# Altium schematic sheet jtag.SchDoc: TMS320F28388 JTAG/RESET/OSC
size A4; SheetNumber: 6; SheetTotal: 17
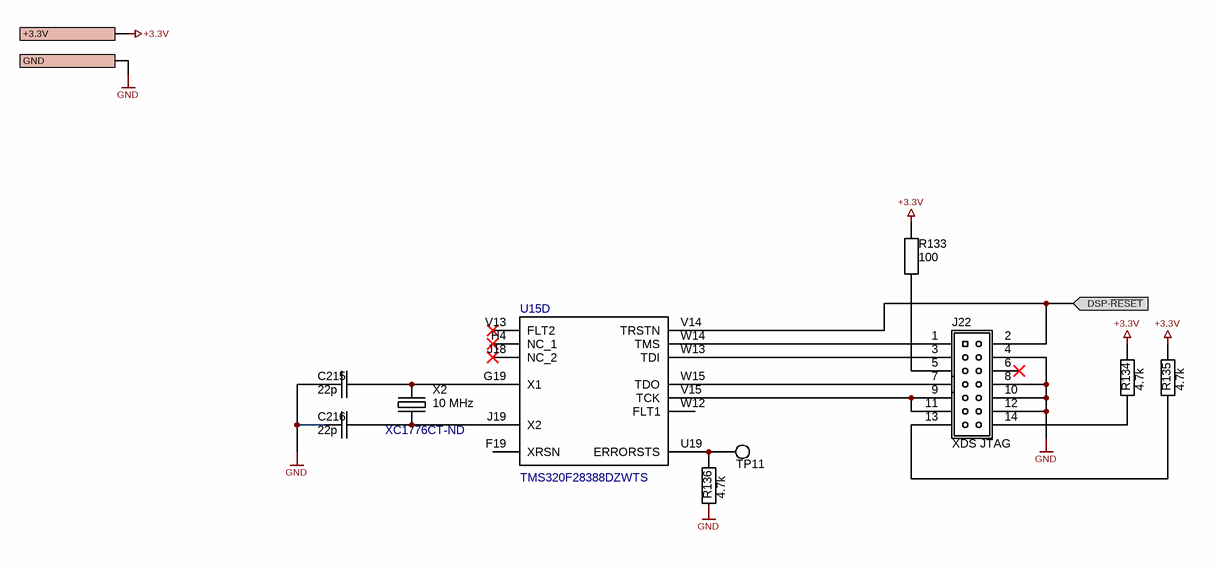
[diagram p0: jtag.SchDoc]

## Parts
C215  22p  [SM/C0402]
C216  22p  [SM/C0402]
J22  XDS JTAG  [SAMTEC_SHF-107-01-L-D-SM]
R133  100  [SM/R0402]
R134  4.7k  [SM/R0402]
R135  4.7k  [SM/R0402]
R136  4.7k  [SM/R0402]
TP11  RCUCTE  [TP/RCUCT]  (value not drawn)
U15  TMS320F28388DZWTS  [BGA337C80P19X19_1600X1600X140]  (part D of 4)
X2  10 MHz  Supplier Part Number 1: XC1776CT-ND  [XTAL-ECS-160-20-3X-TR]

## Ports
+3.3V, DSP-~{RESET} (in), GND

## Nets
+3.3V: R133.2 R134.1 R135.1 ; port +3.3V
GND: C215.2 C216.2 J22.4 J22.8 J22.10 J22.12 R136.2 ; port GND
DSP-~{RESET}: J22.2 U15.V14(TRSTN) ; port DSP-~{RESET}
NetC215_1: C215.1 U15.G19(X1) X2.2
NetC216_1: C216.1 U15.J19(X2) X2.1
NetJ22_1: J22.1 U15.W14(TMS)
NetJ22_3: J22.3 U15.W13(TDI)
NetJ22_5: J22.5 R133.1
NetJ22_7: J22.7 U15.W15(TDO)
NetJ22_9: J22.9 J22.11 U15.V15(TCK)
NetJ22_13: J22.13 R135.2
NetJ22_14: J22.14 R134.2
NetR136_1: R136.1 TP11.1 U15.U19(ERRORSTS)

Not connected (* = marked no-connect by the designer): J22 6*; U15 F19(XRSN) H4(NC_1)* J18(NC_2)* V13(FLT2)* W12(FLT1)

## Notes on the sheet
- HES-SO / HEIG-VD / TIN / IAI
  Route de Cheseaux, 1
  CH-1401 Yverdon-les-Bains
  +41 24 557 73 77
  http://iai.heig-vd.ch
  iai@heig-vd.ch
- Title
- Format
- Date
- A4
- Project Name
- Author
- Project ID
- VCS
- Revision
- Page
- /
- File

## Library data of the parts
C215 C216 = C: 22 pF ±2% 50V Ceramic Capacitor C0G, NP0 0402 (1005 Metric); Dielectric: NPO; Supplier 1: Digi-Key; Supplier Part Number 1: 311-1652-1-ND; Value: 22p; Voltage: 50V
J22 = CONN 14POS: Supplier 1: Digi-Key; Supplier Part Number 1: ESHF-107-01-L-D-SM-ND
R133 = R: 100 Ohms ±1% 0.063W, 1/16W Chip Resistor 0402 (1005 Metric) Moisture Resistant Thick Film; Supplier 1: Digi-Key; Supplier Part Number 1: 311-100LRCT-ND; Value: 100
R134-R136 = R: 4.7 kOhms ±5% 0.063W, 1/16W Chip Resistor 0402 (1005 Metric) Moisture Resistant Thick Film; Supplier 1: Digi-Key; Supplier Part Number 1: 311-4.7KJRCT-ND; Value: 4.7k
TP11 = TP: PC Test Point Plating Surface Mount Mounting Type; Supplier 1: Digi-Key; Supplier Part Number 1: 2019-RCUCTECT-ND
U15 = TMS320F28388DZWTS: Integrated Circuit; Datasheet Link: http://www.ti.com/lit/ds/symlink/tms320f28388d.pdf; Height: 1.4mm; Supplier 1: Mouser; Supplier Part Number 1: 595-F28388DZWTS
X2 = XTAL: Value: 10MHz; Supplier 1: Digi-Key